# EAGLE schematic MasterMoanna v13 (EAGLE 9.7.0)

## Sheet 1 of 3
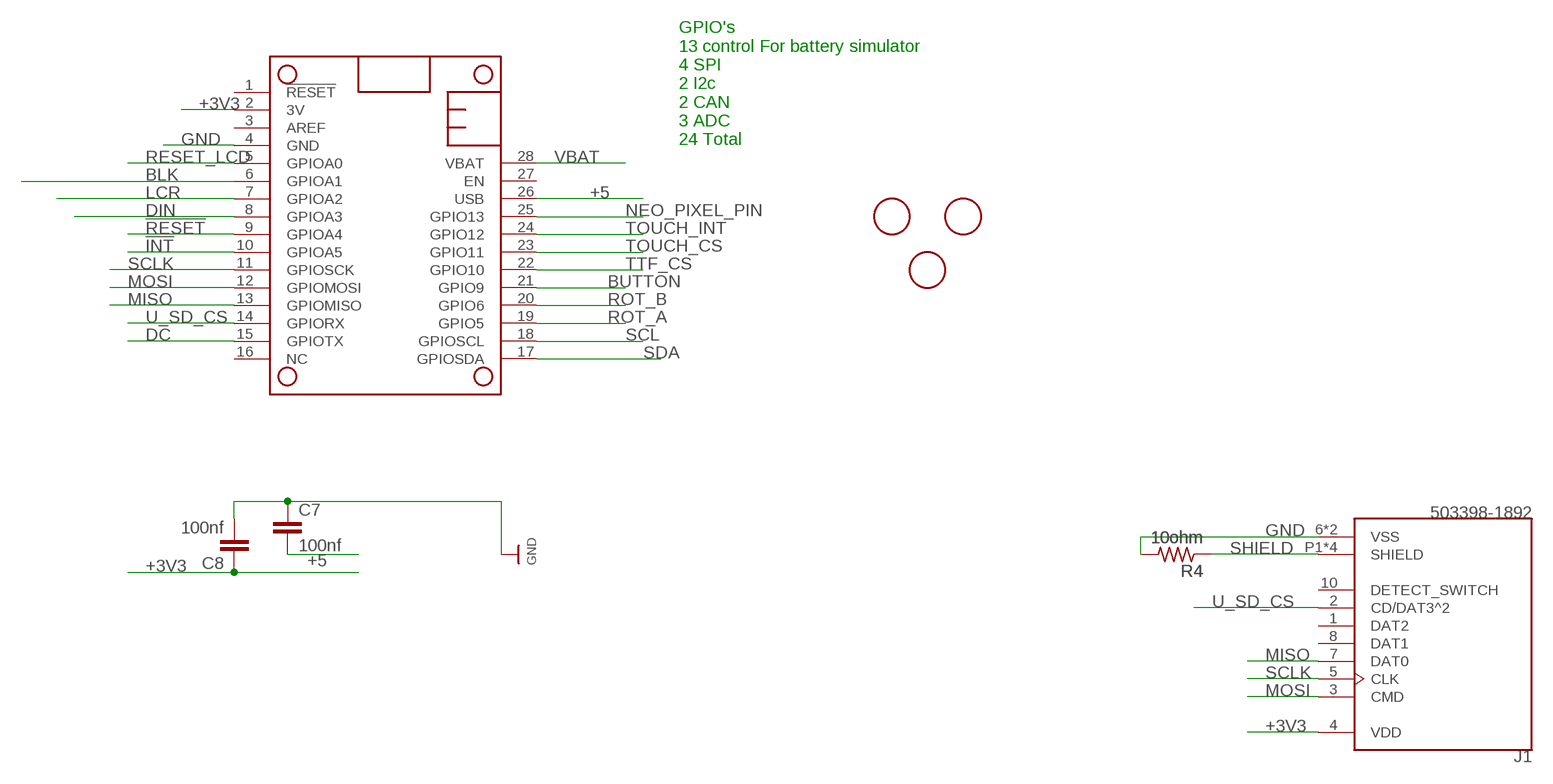
[diagram p0: schematic, sheet 1]

### Parts
C7  100nf  C-EUC0805  [C0805]
C8  100nf  C-EUC0805  [C0805]
FID1  FIDUCIAL  [FIDUCIAL_1MM]
FID2  FIDUCIAL  [FIDUCIAL_1MM]
FID3  FIDUCIAL  [FIDUCIAL_1MM]
J1  503398-1892  [MOLEX_503398-1892]
MS2  FEATHERWING_NODIM  [FEATHERWING_DIM]
R4  10ohm  R-US_M0805  [M0805]

### Nets
!INT: MS2.10(GPIOA5) ; also sheet 2,3
!RESET: MS2.9(GPIOA4) ; also sheet 2,3
+3V3: C8.1 J1.4(VDD) MS2.2(3V) ; also sheet 2,3
+5: C7.2 MS2.26(USB) ; also sheet 3
BLK: MS2.6(GPIOA1) ; also sheet 2,3
BUTTON: MS2.21(GPIO9) ; also sheet 2
DC: MS2.15(GPIOTX) ; also sheet 2
DIN: MS2.8(GPIOA3) ; also sheet 2,3
GND: C7.1 C8.2 J1.6(VSS) J1.9(VSS) MS2.4(GND) R4.2 ; also sheet 2,3
LCR: MS2.7(GPIOA2) ; also sheet 2,3
MISO: J1.7(DAT0) MS2.13(GPIOMISO) ; also sheet 2
MOSI: J1.3(CMD) MS2.12(GPIOMOSI) ; also sheet 2
NEO_PIXEL_PIN: MS2.25(GPIO13) ; also sheet 2,3
RESET_LCD: MS2.5(GPIOA0) ; also sheet 2
ROT_A: MS2.19(GPIO5) ; also sheet 2
ROT_B: MS2.20(GPIO6) ; also sheet 2
SCL: MS2.18(GPIOSCL) ; also sheet 2,3
SCLK: J1.5(CLK) MS2.11(GPIOSCK) ; also sheet 2
SDA: MS2.17(GPIOSDA) ; also sheet 2,3
SHIELD: J1.P1(SHIELD) J1.P2(SHIELD) J1.P3(SHIELD) J1.P4(SHIELD) R4.1
TOUCH_CS: MS2.23(GPIO11) ; also sheet 2
TOUCH_INT: MS2.24(GPIO12) ; also sheet 2
TTF_CS: MS2.22(GPIO10) ; also sheet 2
U_SD_CS: J1.2(CD/DAT3^2) MS2.14(GPIORX)
VBAT: MS2.28(VBAT)
Unconnected: J1.1(DAT2) J1.8(DAT1) J1.10(DETECT_SWITCH) MS2.1(!RESET) MS2.3(AREF) MS2.16(NC) MS2.27(EN)

### Notes on the sheet
- GPIO's
  13 control For battery simulator
  4 SPI
  2 I2c
  2 CAN
  3 ADC
  24 Total

## Sheet 2 of 3
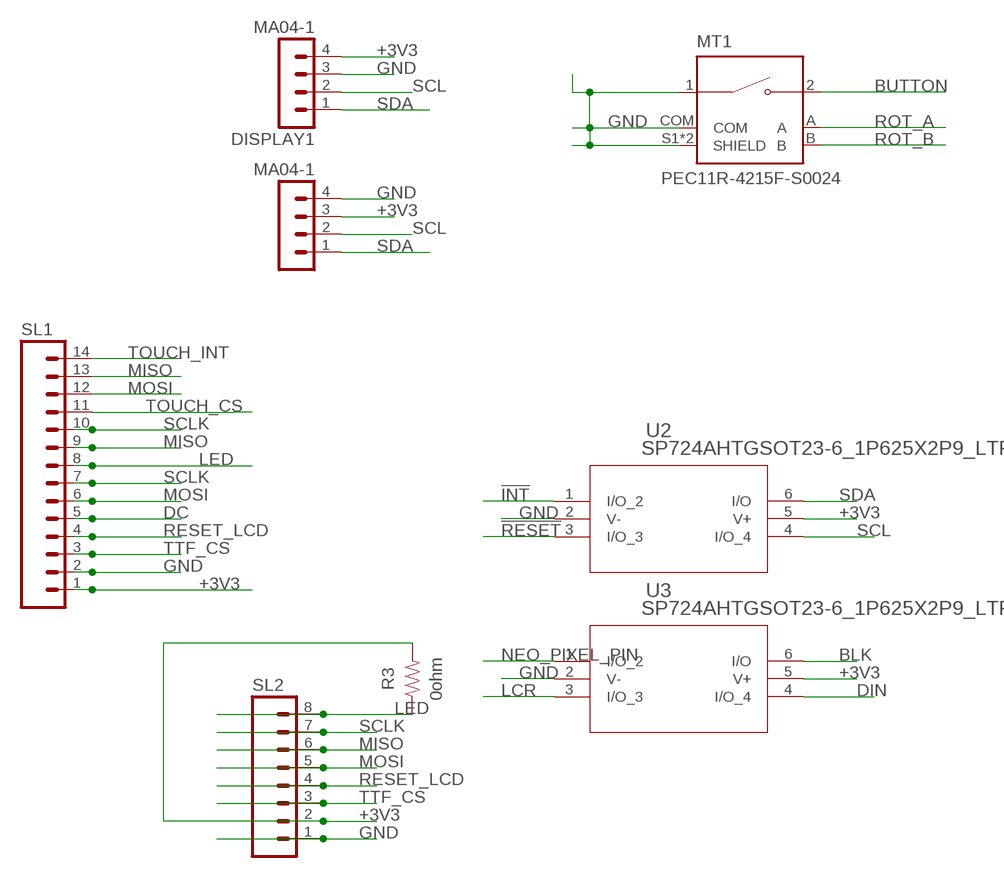
[diagram p1: schematic, sheet 2]

### Parts
DISPLAY  MA04-1  [MA04-1]
DISPLAY1  MA04-1  [MA04-1]
MT1  PEC11R-4215F-S0024  [XDCR_PEC11R-4215F-S0024]
R3  0ohm  R-US_CHIP-0805(2012-METRIC)  [RESC2012X65]
SL1  MA14  [14PA]
SL2  MA08  [08PA]
U2  SP724AHTGSOT23-6_1P625X2P9_LTF  [SOT23-6_1P625X2P9_LTF]
U3  SP724AHTGSOT23-6_1P625X2P9_LTF  [SOT23-6_1P625X2P9_LTF]

### Nets
!INT: U2.1(I/O_2) ; also sheet 1,3
!RESET: U2.3(I/O_3) ; also sheet 1,3
+3V3: DISPLAY1.4(D) DISPLAY.3(C) R3.2 SL1.1 SL2.2 U2.5(V+) U3.5(V+) ; also sheet 1,3
BLK: U3.6(I/O) ; also sheet 1,3
BUTTON: MT1.2 ; also sheet 1
DC: SL1.5 ; also sheet 1
DIN: U3.4(I/O_4) ; also sheet 1,3
GND: DISPLAY1.3(C) DISPLAY.4(D) MT1.1 MT1.COM MT1.S1(SHIELD) MT1.S2(SHIELD) SL1.2 SL2.1 U2.2(V-) U3.2(V-) ; also sheet 1,3
LCR: U3.3(I/O_3) ; also sheet 1,3
LED: R3.1 SL1.8 SL2.8
MISO: SL1.9 SL1.13 SL2.6 ; also sheet 1
MOSI: SL1.6 SL1.12 SL2.5 ; also sheet 1
NEO_PIXEL_PIN: U3.1(I/O_2) ; also sheet 1,3
RESET_LCD: SL1.4 SL2.4 ; also sheet 1
ROT_A: MT1.A ; also sheet 1
ROT_B: MT1.B ; also sheet 1
SCL: DISPLAY1.2(B) DISPLAY.2(B) U2.4(I/O_4) ; also sheet 1,3
SCLK: SL1.7 SL1.10 SL2.7 ; also sheet 1
SDA: DISPLAY1.1(A) DISPLAY.1(A) U2.6(I/O) ; also sheet 1,3
TOUCH_CS: SL1.11 ; also sheet 1
TOUCH_INT: SL1.14 ; also sheet 1
TTF_CS: SL1.3 SL2.3 ; also sheet 1

## Sheet 3 of 3
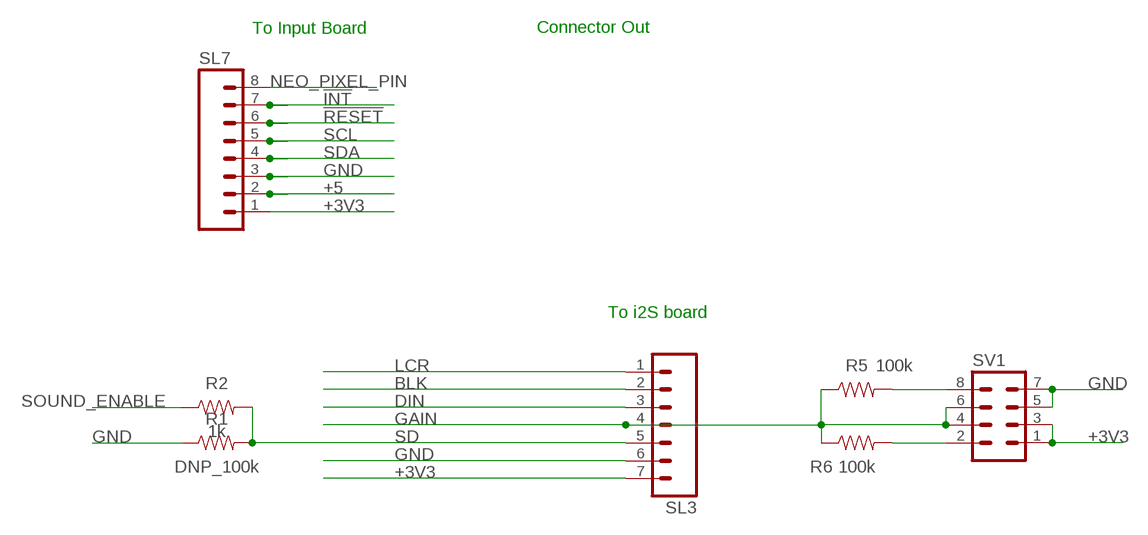
[diagram p2: schematic, sheet 3]

### Parts
R1  DNP_100k  R-US_CHIP-0805(2012-METRIC)  [RESC2012X65]
R2  1k  R-US_CHIP-0805(2012-METRIC)  [RESC2012X65]
R5  100k  R-US_CHIP-0805(2012-METRIC)  [RESC2012X65]
R6  100k  R-US_CHIP-0805(2012-METRIC)  [RESC2012X65]
SL3  MA07  [07PA]
SL7  MA08  [08PA]
SV1  MA04-2  [MA04-2]

### Nets
!INT: SL7.7 ; also sheet 1,2
!RESET: SL7.6 ; also sheet 1,2
+3V3: SL3.7 SL7.1 SV1.1 SV1.3 ; also sheet 1,2
+5: SL7.2 ; also sheet 1
BLK: SL3.2 ; also sheet 1,2
DIN: SL3.3 ; also sheet 1,2
GAIN: R5.1 R6.1 SL3.4 SV1.4 SV1.6
GND: R1.1 SL3.6 SL7.3 SV1.5 SV1.7 ; also sheet 1,2
LCR: SL3.1 ; also sheet 1,2
N$1: R5.2 SV1.8
N$2: R6.2 SV1.2
NEO_PIXEL_PIN: SL7.8 ; also sheet 1,2
SCL: SL7.5 ; also sheet 1,2
SD: R1.2 R2.2 SL3.5
SDA: SL7.4 ; also sheet 1,2
SOUND_ENABLE: R2.1

### Notes on the sheet
- To Input Board
- Connector Out
- To i2S board

## Library data of the parts
C7 C8 = resistor:C-EU: CAPACITOR, European symbol; HEIGHT: 1
DISPLAY DISPLAY1 = SSIRacing:MA04-1
FID1-FID3 = adafruit:FIDUCIAL: For use by pick and place machines to calibrate the vision/machine, 1mm By microbuilder.eu
J1 = 503398-1892:503398-1892: 1.10mm Pitch microSD Memory Card Connector, Normal Mount Surface Mount, Push-Push Type, 1.28mm Height; DESCRIPTION: 9 (8 + 1) Position Card Connector Secure Digital - microSD™ Surface Mount, Right Angle Gold; DIGI-KEY_PART_NUMBER: WM11190TR-ND; MF: Molex; MP: 5033981892; PACKAGE: None; PURCHASE-URL: https://pricing.snapeda.com/search/part/5033981892/?ref=eda
MS2 = adafruit:FEATHERWING
MT1 = PEC11R-4215F-S0024:PEC11R-4215F-S0024: Incremental Encoder, 12 Mm, Contact Rating 10 Ma - 5 Vdc Check availability <https://pricing.snapeda.com/parts/PEC11R-4215F-S0024/Bourns/view-part?ref=eda>; AVAILABILITY: In Stock; DESCRIPTION: Rotary Encoder Mechanical 24 Quadrature (Incremental) Vertical; MF: Bourns; MP: PEC11R-4215F-S0024; PACKAGE: None; PRICE: None; PURCHASE-URL: https://pricing.snapeda.com/search/part/PEC11R-4215F-S0024/?ref=eda
R1-R3 R5 R6 = Resistor:R-US: Resistor Fixed - ANSI; CATEGORY: Resistors; DESCRIPTION: Chip Resistor 2.00 X 1.25 X 0.65 mm body 0805(2012-METRIC) Package; PACKAGE_SIZE: 0805; PACKAGE_TYPE: SMD
R4 = resistor:R-US_: RESISTOR, American symbol
SL1 = con-amp-quick:MA14: AMP QUICK CONNECTOR; OC_FARNELL: unknown; OC_NEWARK: unknown
SL2 SL7 = con-amp-quick:MA08: AMP QUICK CONNECTOR; OC_FARNELL: unknown; OC_NEWARK: unknown
SL3 = con-amp-quick:MA07: AMP QUICK CONNECTOR; OC_FARNELL: unknown; OC_NEWARK: unknown
SV1 = con-lstb:MA04-2: PIN HEADER; OC_FARNELL: unknown; OC_NEWARK: unknown
U2 U3 = 2022-12-15_20-19-59_Library:SP724AHTG; COPYRIGHT: Copyright (C) 2022 Ultra Librarian. All rights reserved.; DIGI-KEY_PART_NUMBER_1: F2863TR-ND; DIGI-KEY_PART_NUMBER_2: F2863CT-ND; DIGI-KEY_PART_NUMBER_3: F2863DKR-ND; MANUFACTURER_PART_NUMBER: SP724AHTG; MFR_NAME: Littelfuse Inc

## Net classes
1 USB: width 0.275 mm, clearance 0.152 mm